# EAGLE schematic row_driver (EAGLE 6.4)
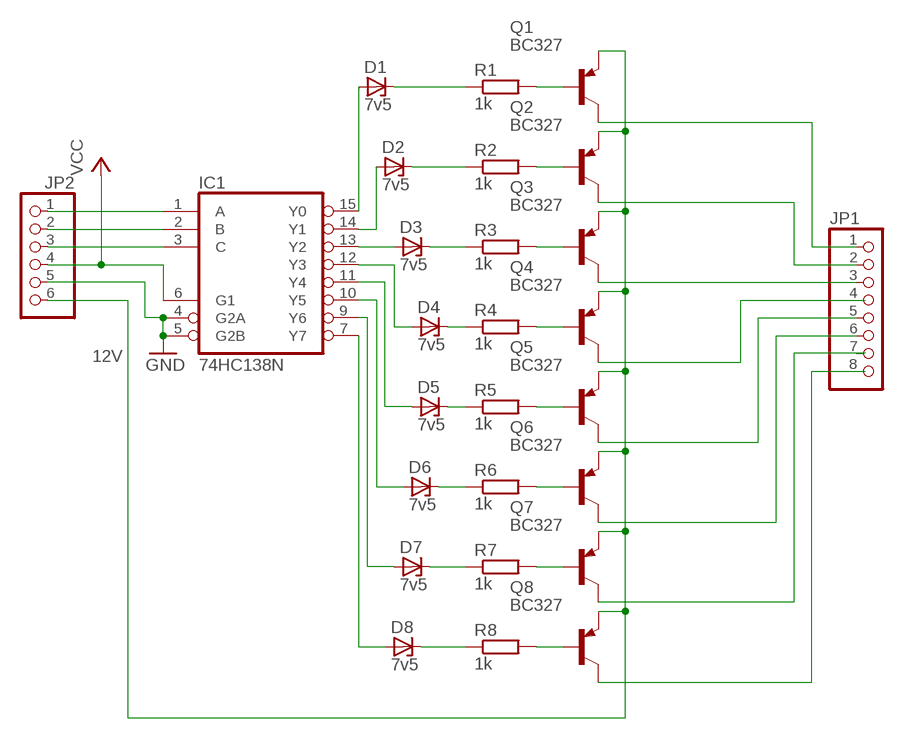
[diagram p0: schematic, sheet 1]

## Parts
D1  7v5  ZENER-DIODEDO34-7  [DO34Z7]
D2  7v5  ZENER-DIODEDO34-7  [DO34Z7]
D3  7v5  ZENER-DIODEDO34-7  [DO34Z7]
D4  7v5  ZENER-DIODEDO34-7  [DO34Z7]
D5  7v5  ZENER-DIODEDO34-7  [DO34Z7]
D6  7v5  ZENER-DIODEDO34-7  [DO34Z7]
D7  7v5  ZENER-DIODEDO34-7  [DO34Z7]
D8  7v5  ZENER-DIODEDO34-7  [DO34Z7]
IC1  74HC138N  [DIL16]
JP1  PINHD-1X8  [1X08]
JP2  PINHD-1X6  [1X06]
Q1  BC327  [TO92]
Q2  BC327  [TO92]
Q3  BC327  [TO92]
Q4  BC327  [TO92]
Q5  BC327  [TO92]
Q6  BC327  [TO92]
Q7  BC327  [TO92]
Q8  BC327  [TO92]
R1  1k  R-EU_0207/12  [0207/12]
R2  1k  R-EU_0207/12  [0207/12]
R3  1k  R-EU_0207/12  [0207/12]
R4  1k  R-EU_0207/12  [0207/12]
R5  1k  R-EU_0207/12  [0207/12]
R6  1k  R-EU_0207/12  [0207/12]
R7  1k  R-EU_0207/12  [0207/12]
R8  1k  R-EU_0207/12  [0207/12]

## Nets
12V: JP2.6 Q1.1(E) Q2.1(E) Q3.1(E) Q4.1(E) Q5.1(E) Q6.1(E) Q7.1(E) Q8.1(E)
GND: IC1.4(G2A) IC1.5(G2B) JP2.5
N$1: D1.A IC1.15(Y0)
N$2: D5.A IC1.11(Y4)
N$3: IC1.1(A) JP2.1
N$4: IC1.2(B) JP2.2
N$5: IC1.3(C) JP2.3
N$8: D4.C R4.1
N$9: Q4.2(B) R4.2
N$10: Q5.2(B) R5.2
N$11: R5.1
N$12: D6.C R6.1
N$13: Q6.2(B) R6.2
N$14: Q7.2(B) R7.2
N$15: D7.C R7.1
N$16: D8.C R8.1
N$17: Q8.2(B)
N$18: D1.C R1.1
N$19: D2.C R2.1
N$20: D3.C R3.1
N$21: Q3.2(B) R3.2
N$22: Q2.2(B) R2.2
N$23: Q1.2(B) R1.2
N$24: JP1.1 Q1.3(C)
N$25: JP1.2 Q2.3(C)
N$26: JP1.3 Q3.3(C)
N$27: Q4.3(C)
N$28: JP1.5 Q5.3(C)
N$29: JP1.6 Q6.3(C)
N$30: Q7.3(C)
N$31: Q8.3(C)
N$32: D2.A IC1.14(Y1)
N$33: D3.A IC1.13(Y2)
N$34: D4.A IC1.12(Y3)
N$35: D8.A IC1.7(Y7)
N$36: D7.A IC1.9(Y6)
N$37: D6.A IC1.10(Y5)
VCC: IC1.6(G1) JP2.4
Unconnected: D5.C JP1.4 JP1.7 JP1.8 R8.2

## Power pins joined to a net without a drawn wire
GND: IC1.8(GND)
VCC: IC1.16(VCC)

## Library data of the parts
D1-D8 = diode:ZENER-DIODE: Z-Diode
IC1 = 74xx-eu:74*138: 3-line to 8-line DECODER/DEMULTIPLEXER
JP1 = pinhead:PINHD-1X8: PIN HEADER
JP2 = pinhead:PINHD-1X6: PIN HEADER
Q1-Q8 = transistor-pnp:BC327: PNP Transistor
R1-R8 = resistor:R-EU_: RESISTOR, European symbol